# Altium schematic sheet Sheet2.SchDoc
size A4
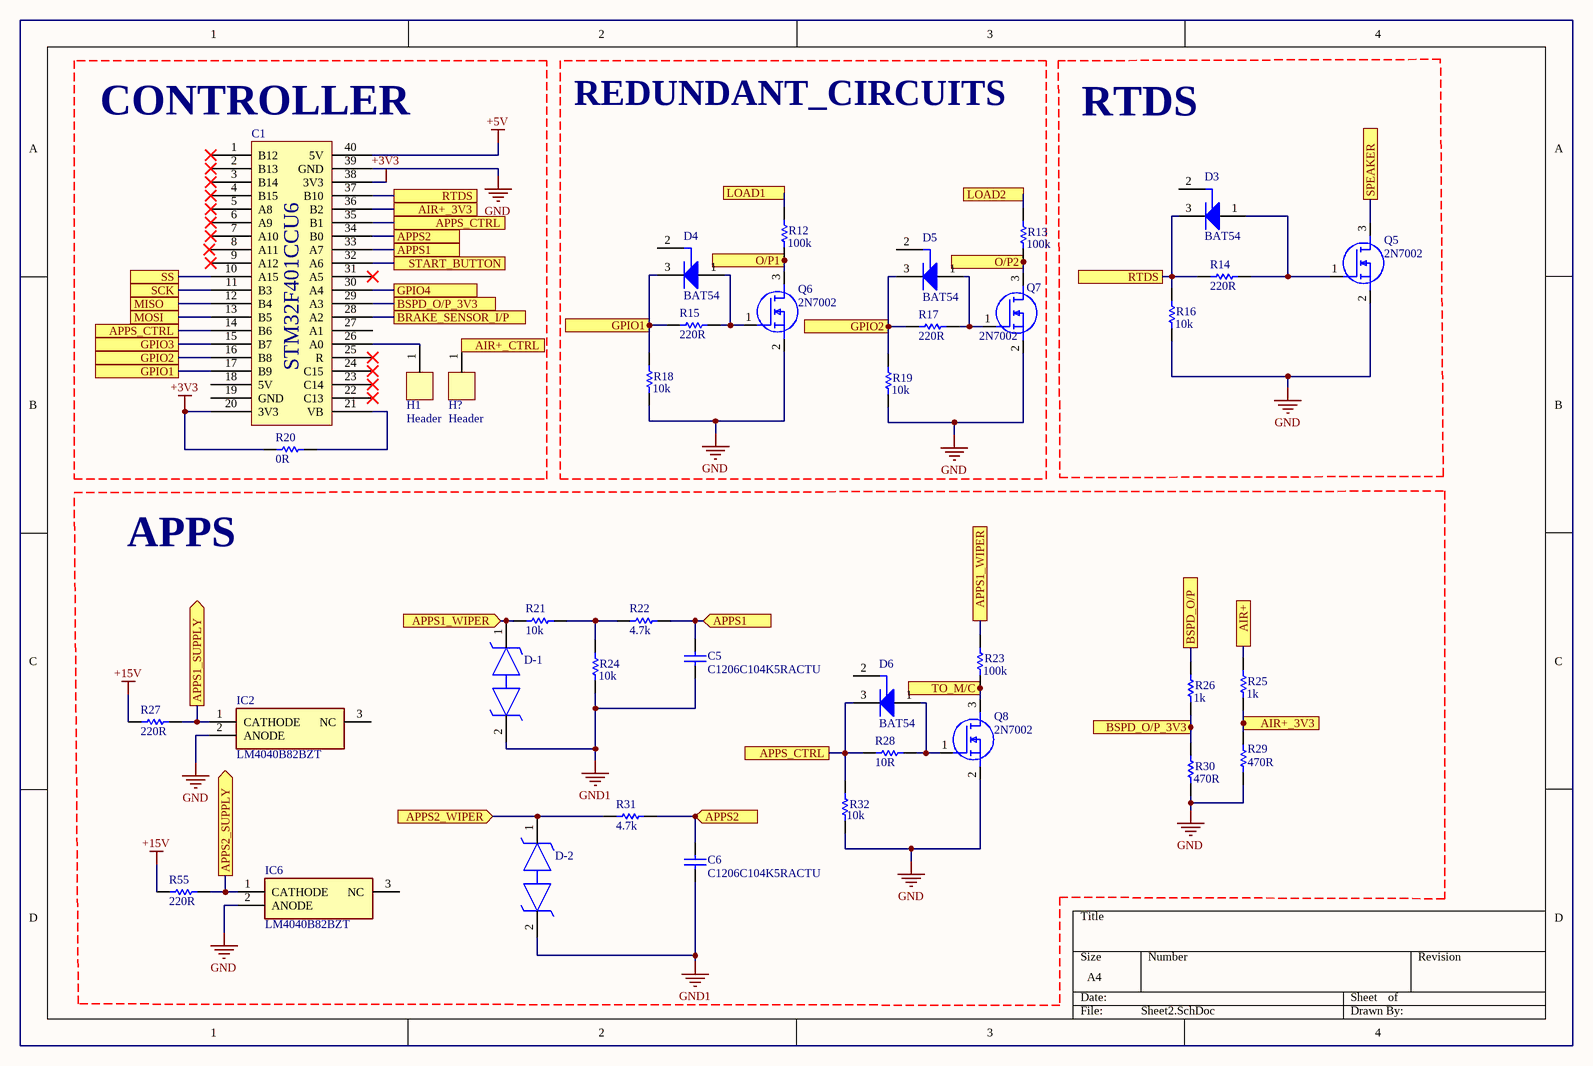
[diagram p0: Sheet2.SchDoc]

## Parts
C1  Component_1  [PCBComponent_1]  (value not drawn)
C5  C1206C104K5RACTU  [KEMT-1206-2_N]
C6  C1206C104K5RACTU  [KEMT-1206-2_N]
D3  BAT54  [INF-SOT23_N]
D4  BAT54  [INF-SOT23_N]
D5  BAT54  [INF-SOT23_N]
D6  BAT54  [INF-SOT23_N]
D-1  TPD1E6B06DPLR  [R1206]  (value not drawn)
D-2  TPD1E6B06DPLR  [R1206]  (value not drawn)
H1  Header  [Header]
H?  Header  [Header]
IC2  LM4040B82BZT  [SOT95P237X112-3N]
IC6  LM4040B82BZT  [SOT95P237X112-3N]
Q5  2N7002  [SOT96P240X120-3N]
Q6  2N7002  [SOT96P240X120-3N]
Q7  2N7002  [SOT96P240X120-3N]
Q8  2N7002  [SOT96P240X120-3N]
R12  100k  [RESC3216X60X45NL10T20 - duplicate]
R13  100k  [RESC3216X60X45NL10T20 - duplicate]
R14  220R  [RESC3216X60X45NL10T20 - duplicate]
R15  220R  [RESC3216X60X45NL10T20 - duplicate]
R16  10k  [RESC3216X60X45NL10T20 - duplicate]
R17  220R  [RESC3216X60X45NL10T20 - duplicate]
R18  10k  [RESC3216X60X45NL10T20 - duplicate]
R19  10k  [RESC3216X60X45NL10T20 - duplicate]
R20  0R  [R1206]
R21  10k  [RESC3216X60X45NL10T20 - duplicate]
R22  4.7k  [RESC3216X60X45NL10T20 - duplicate]
R23  100k  [RESC3216X60X45NL10T20 - duplicate]
R24  10k  [RESC3216X60X45NL10T20 - duplicate]
R25  1k  [RESC3216X60X45NL10T20 - duplicate]
R26  1k  [RESC3216X60X45NL10T20 - duplicate]
R27  220R  [RESC3216X60X45NL10T20 - duplicate]
R28  10R  [RESC3216X60X45NL10T20 - duplicate]
R29  470R  [R1206]
R30  470R  [RESC3216X60X45NL10T20 - duplicate]
R31  4.7k  [RESC3216X60X45NL10T20 - duplicate]
R32  10k  [RESC3216X60X45NL10T20 - duplicate]
R55  220R  [RESC3216X60X45NL10T20 - duplicate]

## Blocks framed on the sheet
CONTROLLER: C1 H1 H? R20
REDUNDANT_CIRCUITS: D4 D5 Q6 Q7 R12 R13 R15 R17-R19
APPS: C5 C6 D6 D-1 D-2 IC2 IC6 Q8 R21-R32 R55

## Ports
AIR+, AIR+_3V3, AIR+_CTRL, APPS1, APPS1 (in), APPS1_SUPPLY (out), APPS1_WIPER, APPS1_WIPER (in), APPS2, APPS2 (in), APPS2_SUPPLY (out), APPS2_WIPER (in), APPS_CTRL, BRAKE_SENSOR_I/P, BSPD_O/P, BSPD_O/P_3V3, GPIO1, GPIO2, GPIO3, GPIO4, LOAD1, LOAD2, MISO, MOSI, O/P1, O/P2, RTDS, SCK, SPEAKER, SS, START_BUTTON, TO_M/C

## Nets
+3V3: C1.20(3V3) C1.38(3V3) R20.1
+5V: C1.40(5V)
+15V: R27.2 R55.2
GND: C1.39(GND) IC2.2(ANODE) IC6.2(ANODE) Q5.2(S) Q6.2(S) Q7.2(S) Q8.2(S) R16.1 R18.1 R19.1 R29.1 R30.1 R32.1
GND1: C5.1 C6.1 D-1.2 D-2.2 R24.1
AIR+: R25.2 ; port AIR+
AIR+_3V3: C1.36(B2) R25.1 R29.2 ; port AIR+_3V3
AIR+_CTRL: H?.1 ; port AIR+_CTRL
APPS1: C1.33(A7) C5.2 R22.1 ; port APPS1
APPS1_SUPPLY: IC2.1(CATHODE) R27.1 ; port APPS1_SUPPLY
APPS1_WIPER: D-1.1 R21.2 R23.2 ; port APPS1_WIPER
APPS2: C1.34(B0) C6.2 R31.1 ; port APPS2
APPS2_SUPPLY: IC6.1(CATHODE) R55.1 ; port APPS2_SUPPLY
APPS2_WIPER: D-2.1 R31.2 ; port APPS2_WIPER
APPS_CTRL: C1.14(B6) C1.35(B1) D6.3(K) R28.2 R32.2 ; port APPS_CTRL
BRAKE_SENSOR_I/P: C1.28(A2) ; port BRAKE_SENSOR_I/P
BSPD_O/P: R26.2 ; port BSPD_O/P
BSPD_O/P_3V3: C1.29(A3) R26.1 R30.2 ; port BSPD_O/P_3V3
GPIO1: C1.17(B9) D4.3(K) R15.2 R18.2 ; port GPIO1
GPIO2: C1.16(B8) D5.3(K) R17.2 R19.2 ; port GPIO2
GPIO3: C1.15(B7) ; port GPIO3
GPIO4: C1.30(A4) ; port GPIO4
LOAD1: R12.2 ; port LOAD1
LOAD2: R13.2 ; port LOAD2
MISO: C1.12(B4) ; port MISO
MOSI: C1.13(B5) ; port MOSI
O/P1: Q6.3(D) R12.1 ; port O/P1
O/P2: Q7.3(D) R13.1 ; port O/P2
RTDS: C1.37(B10) D3.3(K) R14.2 R16.2 ; port RTDS
SCK: C1.11(B3) ; port SCK
SPEAKER: Q5.3(D) ; port SPEAKER
SS: C1.10(A15) ; port SS
START_BUTTON: C1.32(A6) ; port START_BUTTON
TO_M/C: Q8.3(D) R23.1 ; port TO_M/C
NetC1_21: C1.21(VB) R20.2
NetC1_26: C1.26(A0) H1.1
NetD3_1: D3.1(A) Q5.1(G) R14.1
NetD4_1: D4.1(A) Q6.1(G) R15.1
NetD5_1: D5.1(A) Q7.1(G) R17.1
NetD6_1: D6.1(A) Q8.1(G) R28.1
NetR21_1: R21.1 R22.2 R24.2

Not connected (* = marked no-connect by the designer): C1 1(B12)* 2(B13)* 3(B14)* 4(B15)* 5(A8)* 6(A9)* 7(A10)* 8(A11) 9(A12)* 18(5V) 19(GND) 22(C13)* 23(C14)* 24(C15)* 25(R)* 27(A1) 31(A5)*; D3 2(NC); D4 2(NC); D5 2(NC); D6 2(NC); IC2 3(NC); IC6 3(NC)

## Notes on the sheet
- RTDS
- (in symbol Component_1) STM32F401CCU6

## Library data of the parts
C5 C6 = CMP-1037-04202-2: CAP, Ceramic, 0.1 uF, +/- 10%, 50 V, -55 to 125 degC, 1206 (3216 Metric), RoHS, Tape and Reel; Manufacturer: Kemet; Voltage Rating: 50V; Capacitance: 0.1µF; Product Range: KEMET-CSeries; SVHC: ToBeAdvised; Dielectric Characteristic: X7R; Capacitor Case Style: 1206[3216Metric]; Package Reference: 1206-2; Package Description: 2-Leads SMD, Body 3.2 x 1.6 mm; Packaging: Tape&Reel; Operating Temperature Max: 125degC; Capacitance Tolerance: ±10%; Datasheet URL: https://datasheet.ciiva.com/6125/1725438-6125494.pdf; Manufacturer URL: http://www.kemet.com/; Operating Temperature Min: -55degC; Datasheet Version: Jul-13
D3-D6 = CMP-1182-00010-1: Silicon Schottky Diode, SOT23, Reel, Green; Manufacturer: Infineon; VF (max): 800Â mV; Configuration: Single; IF (max): 200Â mA; CT (max): 10Â pF; Green: TRUE; VR (max): 30Â V; PartNumber: BAT54; ComponentLink2URL: http://www.infineon.com/dgdl/bat54series.pdf?folderId=db3a30431400ef68011425f1ca2505e3&fileId=db3a304314dca3890115190b74210ea6; ComponentLink3Description: Package Specification; PackageVersion: Apr-08; PackageDescription: 3-Pin Small Outline Transistor Package, 1.3 x 2.9 mm Body, 0.95 mm Pitch; ComponentLink1Description: Manufacturer URL; ComponentLink1URL: http://www.infineon.com/; Mounting Technology: Surface Mount; Packing: Reel; ComponentLink2Description: Datasheet; PackageReference: SOT23; ComponentLink3URL: http://www.infineon.com/dgdl/SOT23-Package_Overview.pdf?folderId=db3a30431936bc4b0119532290053c66&fileId=db3a30431936bc4b0119533468123c85
IC2 IC6 = LM4040B25IDBZT: Integrated Circuit; Manufacturer_Name: Texas Instruments; Datasheet Link: https://www.ti.com/lit/gpn/LM4040; Height: 1.12mm; Manufacturer_Part_Number: LM4040B25IDBZT; Mouser Part Number: 595-LM4040B25IDBZT; Mouser Price/Stock: https://www.mouser.com/Search/Refine.aspx?Keyword=595-LM4040B25IDBZT; Arrow Part Number: LM4040B25IDBZT; Arrow Price/Stock: https://www.arrow.com/en/products/lm4040b25idbzt/texas-instruments
Q5-Q8 = 2N7002: MOSFET (N-Channel); Manufacturer_Name: Vishay; Datasheet Link: https://www.diodes.com/assets/Datasheets/ds11303.pdf; Height: 1.2mm; Manufacturer_Part_Number: 2N7002; Mouser Part Number: 781-2N7002; Mouser Price/Stock: https://www.mouser.co.uk/ProductDetail/Vishay-Siliconix/2N7002?qs=xBpwZ0JX2zKeuvZKtdYLZQ%3D%3D
R12-R19 R21-R28 R30-R32 R55 = CMP-2003-02213-1: Part Number: CRCW120647K0FKEA; Manufacturer: Vishay Dale
R20 R29 = RES: Part Number: CRCW120647K0FKEA; Manufacturer: Vishay Dale